# Altium schematic sheet USBtoSerial.SchDoc
size A
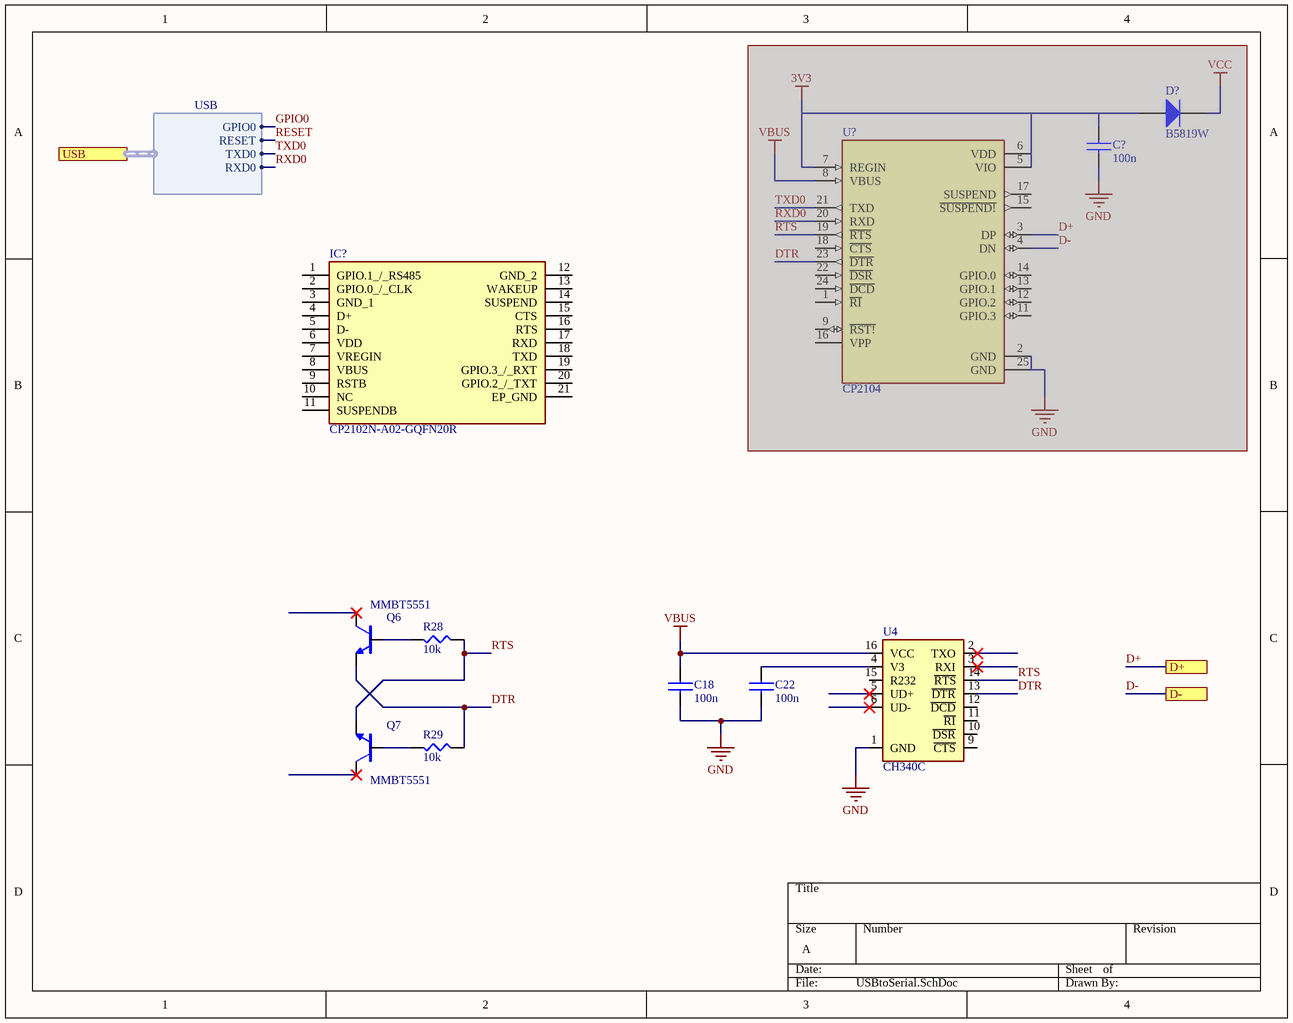
[diagram p0: USBtoSerial.SchDoc]

## Parts
C18  100n  [CAPC160X80X90L35N]
C22  100n  [CAPC160X80X90L35N]
C?  100n  [CAPC160X80X90L35N]  (masked out: inside a compile mask, not in the netlist)
D?  B5819W  [SODFL350X110-2N]  (masked out: inside a compile mask, not in the netlist)
IC?  CP2102N-A02-GQFN20R  [CP2102NA02GQFN20]
Q6  MMBT5551  [SOT23-3P95_240X114L20X40N]
Q7  MMBT5551  [SOT23-3P95_240X114L20X40N]
R28  10k  [RESC200X125X70L40N]
R29  10k  [RESC200X125X70L40N]
U4  CH340C  [SO016]
U?  CP2104  [QFN50P400X400X80-25N]  (masked out: inside a compile mask, not in the netlist)

## Ports
D+, D-, USB (harness USB)

## Harnesses
USB: GPIO0, RESET, TXD0, RXD0

## Nets
GND: C18.2 C22.2 U4.1(GND)
VBUS: C18.1 U4.16(VCC)
D+: port D+
D-: port D-
DTR: Q6.2(E) R29.1 U4.13(~{DTR})
GPIO0: port USB.GPIO0
RESET: port USB.RESET
RTS: Q7.2(E) R28.1 U4.14(~{RTS})
RXD0: port USB.RXD0
TXD0: port USB.TXD0
NetC22_1: C22.1 U4.4(V3)
NetQ6_1: Q6.1(B) R28.2
NetQ7_1: Q7.1(B) R29.2

Not connected (* = marked no-connect by the designer): IC? 1(GPIO.1_/_RS485) 2(GPIO.0_/_CLK) 3(GND_1) 4(D+) 5(D-) 6(VDD) 7(VREGIN) 8(VBUS) 9(RSTB) 10(NC) 11(SUSPENDB) 12(GND_2) 13(WAKEUP) 14(SUSPEND) 15(CTS) 16(RTS) 17(RXD) 18(TXD) 19(GPIO.3_/_RXT) 20(GPIO.2_/_TXT) 21(EP_GND); Q6 3(C)*; Q7 3(C)*; U4 2(TXO)* 3(RXI)* 5(UD+)* 6(UD-)* 9(~{CTS}) 10(~{DSR}) 11(~{RI}) 12(~{DCD}) 15(R232)

## Library data of the parts
C18 C22 C? = Capacitor: Part: USB; Value: 100n; Part Number: *; LCSC Part #: C14663; Package: *
D? = Diode: Part: USB; Part Number: B5819W; LCSC Part #: C8598
IC? = CP2102N-A02-GQFN20R: Integrated Circuit; Manufacturer_Name: Silicon Labs; Datasheet Link: https://componentsearchengine.com//CP2102N-A02-GQFN20R.pdf; Height: 0.8mm; Mouser2 Part Number: 634-CP2102NA02QFN20R; Mouser2 Price/Stock: https://www.mouser.com/Search/Refine.aspx?Keyword=634-CP2102NA02QFN20R; Manufacturer_Part_Number: CP2102N-A02-GQFN20R
Q6 Q7 = MMBT5551: Bipolar _BJT_ Transistor NPN 160V 600mA 225mW Surface Mount SOT-23-3 _TO-236_; Part: USB; MF: ON Semiconductor; Price: None; SnapEDA_Link: https://www.snapeda.com/parts/MMBT5551/ON%20Semiconductor/view-part/2760073/?ref=snap; Availability: Unavailable; Value: *; MP: MMBT5551; Package: SOT-23-3 MCC; LCSC Part #: C2145
R28 R29 = Resistor: Part: USB; Value: 10k; Part Number: *; LCSC Part #: C17414; Package: *
U4 = CH340C: USB to serial chip CH340; MF: WCH; Package: Package; Check_prices: https://www.snapeda.com/parts/CH340C/WCH/view-part/5428851/?ref=eda; Value: *; Price: None; MP: CH340C; Availability: Unavailable; SnapEDA_Link: https://www.snapeda.com/parts/CH340C/WCH/view-part/5428851/?ref=snap; LCSC Part #: C84681
U? = CP2104: USB Bridge, USB to UART USB 2.0 UART Interface 24-QFN _4x4_; MF: Silicon Labs; Price: None; Availability: Unavailable; SnapEDA_Link: https://www.snapeda.com/parts/CP2104/Silicon%20Labs/view-part/135877/?ref=snap; MP: CP2104; Value: *; Package: QFN-24 Silicon Labs; LCSC Part #: C47742; Part: USB